# EAGLE design ASD2020 (EAGLE 6.3)
DATABASE: ./../../../../../Components/TinyCircuits_Part_Database.txt
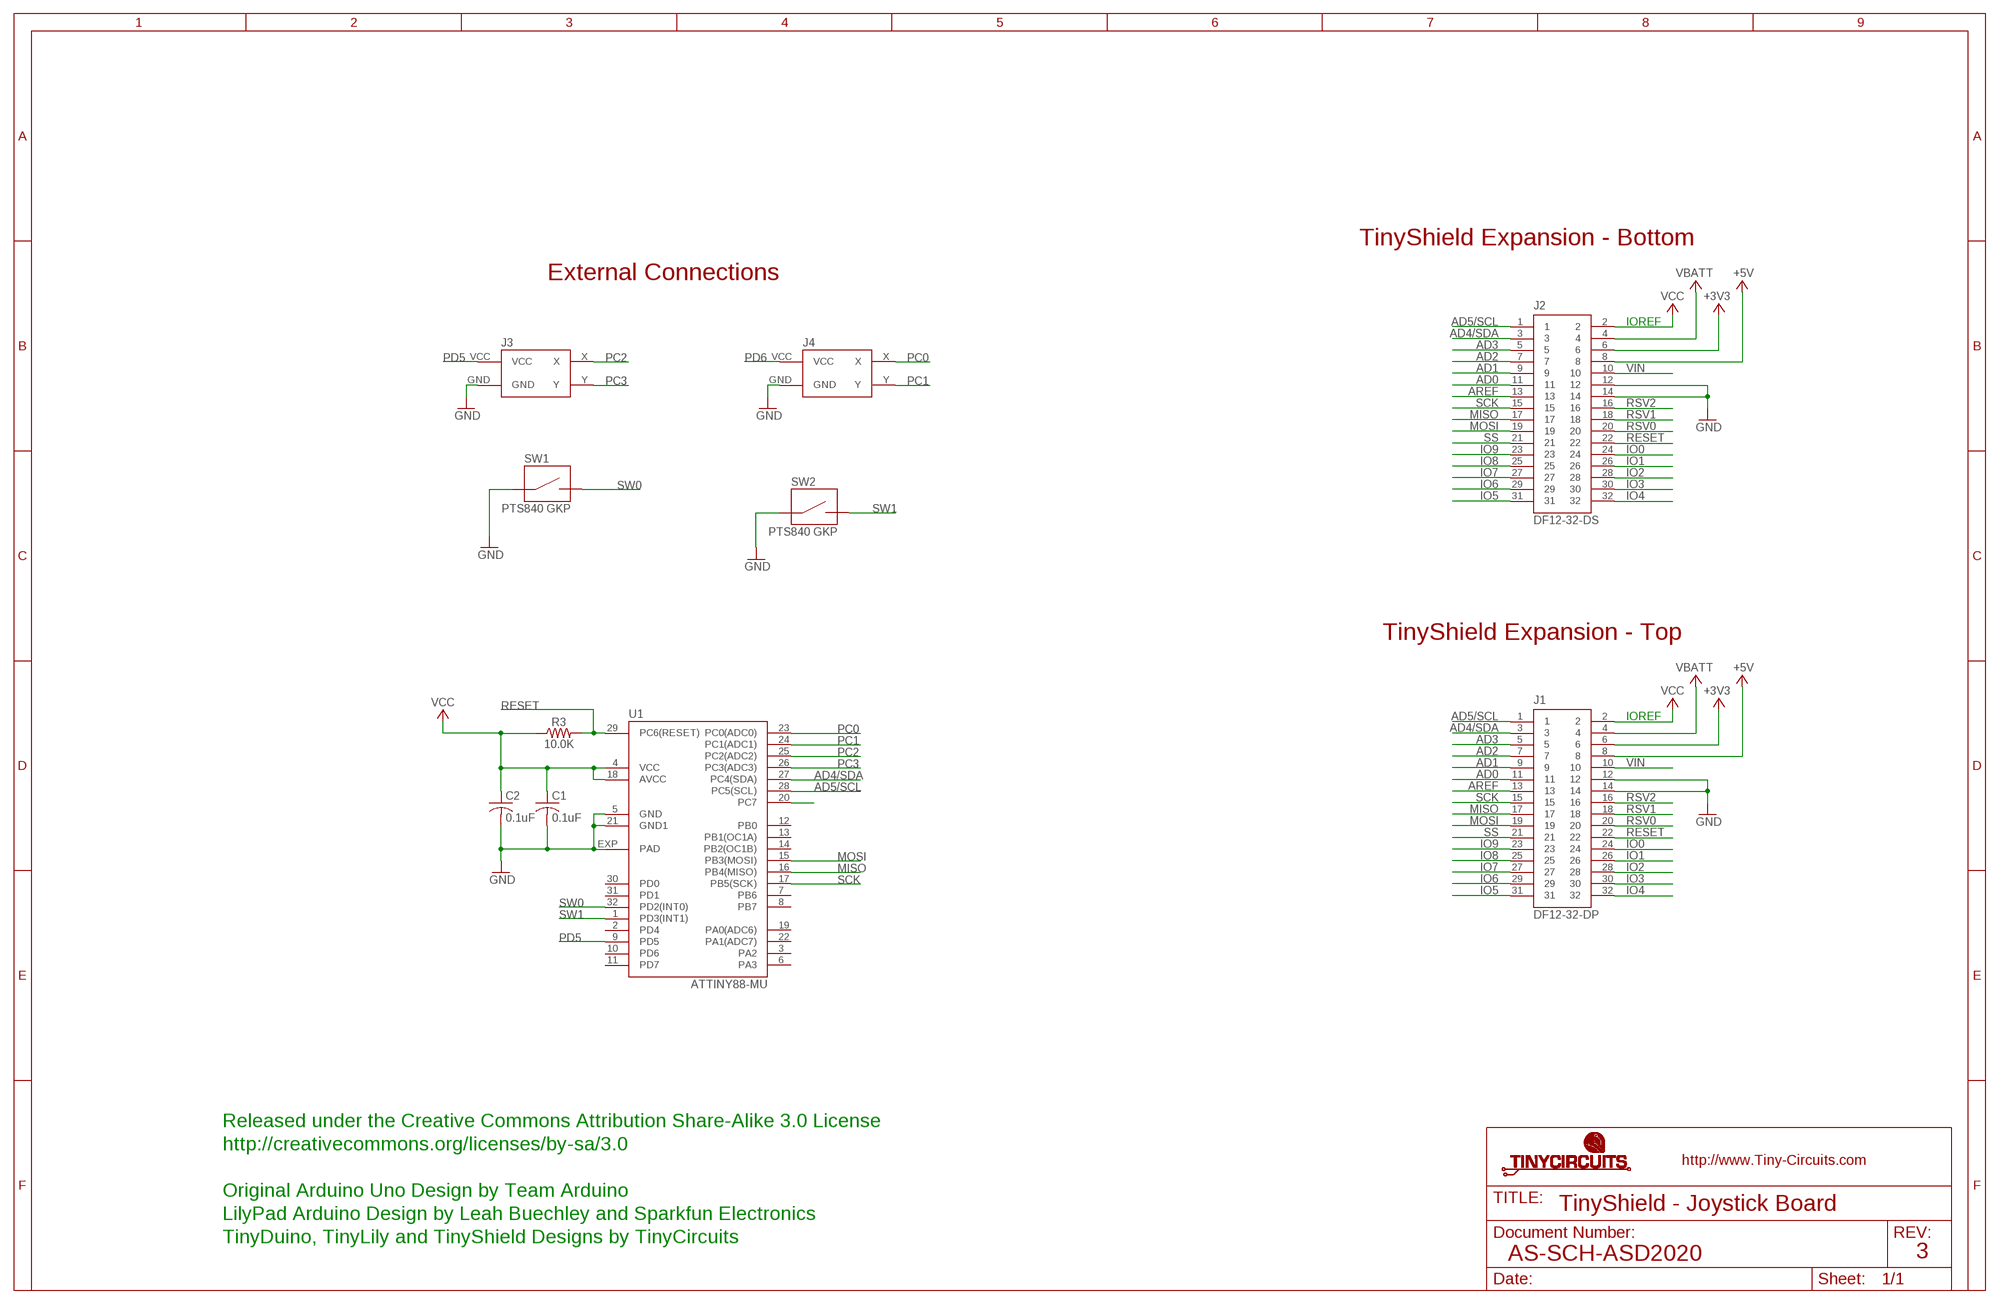
[diagram p0: schematic, sheet 1]

## Parts
C1  0.1uF  AS-ITM-00008  [C0402]
C2  0.1uF  AS-ITM-00008  [C0402]
J1  DF12-32-DP  AS-ITM-00015  [DF12-32-DP]
J2  DF12-32-DS  AS-ITM-00012  [DF12-32-DS]
J3  AS-ITM-00235  [PSPJOYSTICK]
J4  AS-ITM-00235  [PSPJOYSTICK]
R3  10.0K  AS-ITM-00032  [0402]
SW1  PTS840 GKP  AS-ITM-00236  [PTS840GKP]
SW2  PTS840 GKP  AS-ITM-00236  [PTS840GKP]
U1  ATTINY88-MU  AS-ITM-00214  [ATMEL_QFN32]

## Nets
+3V3: J1.6 J2.6
+5V: J1.8 J2.8
AD0: J1.11 J2.11
AD1: J1.9 J2.9
AD2: J1.7 J2.7
AD3: J1.5 J2.5
AD4/SDA: J1.3 J2.3 U1.27(PC4(SDA))
AD5/SCL: J1.1 J2.1 U1.28(PC5(SCL))
AREF: J1.13 J2.13
GND: C1.2 C2.2 J1.12 J1.14 J2.12 J2.14 J3.GND J4.GND SW1.1 SW1.2 SW2.1 SW2.2 U1.5(GND) U1.21(GND1) U1.EXP(PAD)
IO0: J1.24 J2.24
IO1: J1.26 J2.26
IO2: J1.28 J2.28
IO3: J1.30 J2.30
IO4: J1.32 J2.32
IO5: J1.31 J2.31
IO6: J1.29 J2.29
IO7: J1.27 J2.27
IO8: J1.25 J2.25
IO9: J1.23 J2.23
MISO: J1.17 J2.17 U1.16(PB4(MISO))
MOSI: J1.19 J2.19 U1.15(PB3(MOSI))
PC0: J4.X U1.23(PC0(ADC0))
PC1: J4.Y U1.24(PC1(ADC1))
PC2: J3.X U1.25(PC2(ADC2))
PC3: J3.Y U1.26(PC3(ADC3))
PD5: J3.VCC U1.9(PD5)
PD6: J4.VCC U1.20(PC7)
RESET: J1.22 J2.22 R3.2 U1.29(PC6(RESET))
RSV0: J1.20 J2.20
RSV1: J1.18 J2.18
RSV2: J1.16 J2.16
SCK: J1.15 J2.15 U1.17(PB5(SCK))
SS: J1.21 J2.21
SW0: SW1.3 SW1.4 U1.32(PD2(INT0))
SW1: SW2.3 SW2.4 U1.1(PD3(INT1))
VBATT: J1.4 J2.4
VCC: C1.1 C2.1 J1.2 J2.2 R3.1 U1.4(VCC) U1.18(AVCC)
VIN: J1.10 J2.10
Unconnected: U1.2(PD4) U1.3(PA2) U1.6(PA3) U1.7(PB6) U1.8(PB7) U1.10(PD6) U1.11(PD7) U1.12(PB0) U1.13(PB1(OC1A)) U1.14(PB2(OC1B)) U1.19(PA0(ADC6)) U1.22(PA1(ADC7)) U1.30(PD0) U1.31(PD1)

## Notes on the sheet
- TinyShield Expansion - Bottom
- External Connections
- IOREF
- TinyShield Expansion - Top
- IOREF
- Released under the Creative Commons Attribution Share-Alike 3.0 License
- http://creativecommons.org/licenses/by-sa/3.0
- Original Arduino Uno Design by Team Arduino
- TinyShield - Joystick Board
- LilyPad Arduino Design by Leah Buechley and Sparkfun Electronics
- TinyDuino, TinyLily and TinyShield Designs by TinyCircuits
- AS-SCH-ASD2020 | 3

## Library data of the parts
C1 C2 = tinycircuits:AS-ITM-00008: CAP CER 0.1UF 16V 10% X5R 0402; PARTNO: AS-ITM-00008
J1 = tinycircuits:AS-ITM-00015: CONN HEADER 32POS 3MM SMD 0.5MM; PARTNO: AS-ITM-00015
J2 = tinycircuits:AS-ITM-00012: CONN RECEPT 32POS 3MM SMD 0.5MM; PARTNO: AS-ITM-00012
J3 J4 = tinycircuits:AS-ITM-00235: Analog nub
R3 = tinycircuits:AS-ITM-00032: RES 10.0K OHM 1/16W 1% 0402 SMD; PARTNO: AS-ITM-00032
SW1 SW2 = tinycircuits:AS-ITM-00236: SWITCH TACTILE SPST-NO 0.05A 12V; PARTNO: AS-ITM-00236
U1 = tinycircuits:AS-ITM-00214: IC MCU 8BIT 8KB FLASH 32QFN; PARTNO: AS-ITM-00214

## Board
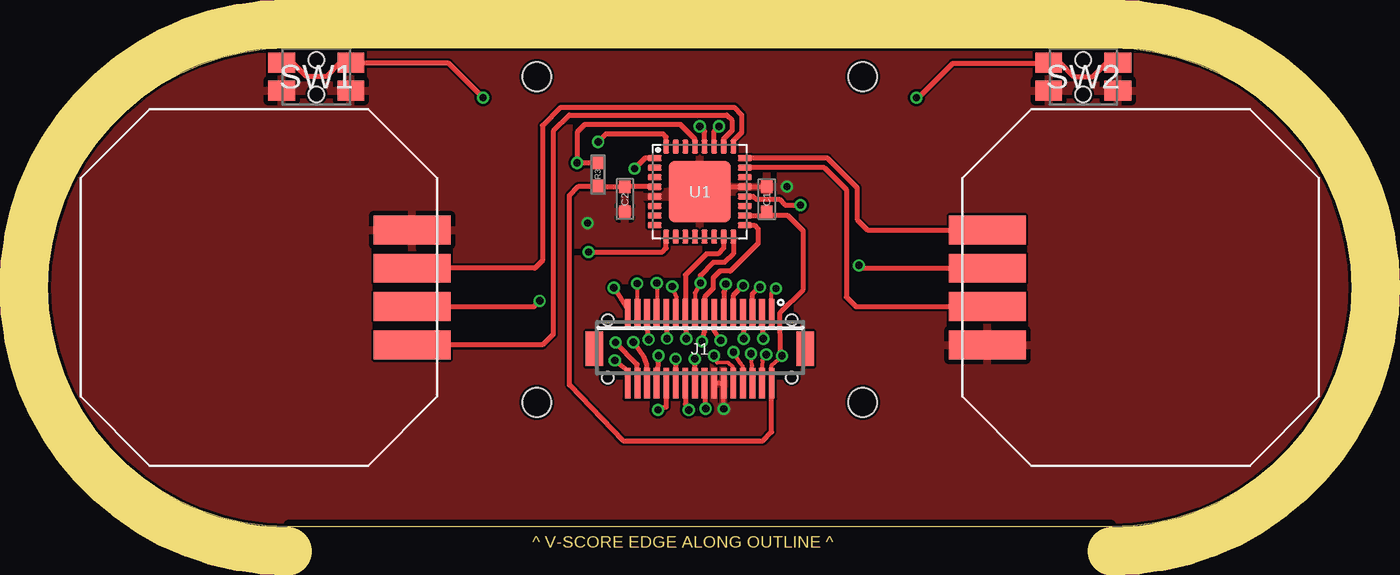
[diagram p1: board, top side]
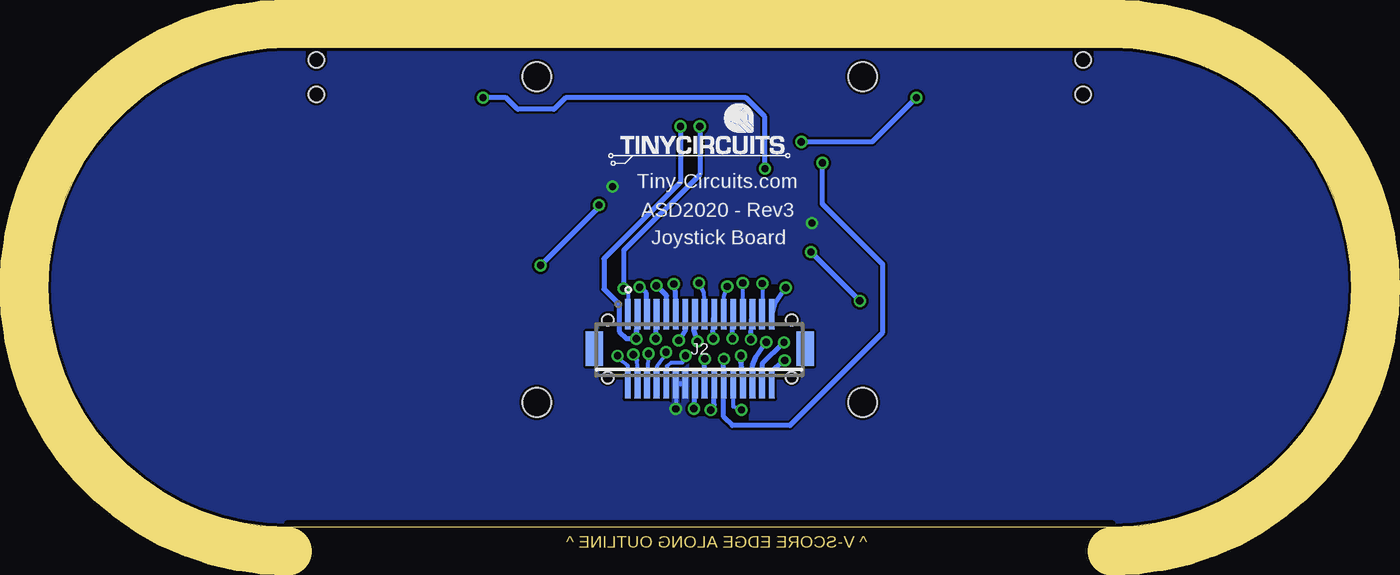
[diagram p2: board, bottom side, seen from below]

Size 68 x 25 mm. Coordinates in mm from the lower left corner, seen from the top.
Outline: 12.5,25 55.5,25 arc-90 68,12.5 arc-90 55.5,0 12.5,0 arc-90 0,12.5 arc-90 12.5,25
Copper layers (1*16): Top 0.035mm / dielectric 1.5mm / Bottom 0.035mm
Design rules "default *": minimum track width 8mil, minimum drill 15mil, track to track 5mil, track to pad 5mil, pad to pad 5mil, via to via 6mil, smd to smd 5mil, copper to edge 6mil, drill to drill 8mil, minimum pad ring 10mil, minimum via ring 5mil, stop-mask expansion 4mil, vias tented up to drill 25mil, thermal gap 10mil
Holes 1.5 mm at 25.5,23.5 42.5,23.5 42.5,6.5 25.5,6.5
tRestrict: 1 lines
bRestrict: 1 lines
Milling: 5 lines

### Footprints (pad centres in the part's own frame; a part is rotated, then mirrored left to right if it is on the bottom)
C0402 = smd 0.65 x 0.6: 1 -0.65,0; 2 0.65,0
DF12-32-DP = smd 0.3 x 1.6: 1 -3.75,-1.8; 2 -3.75,1.8; 3 -3.25,-1.8; 4 -3.25,1.8; 5 -2.75,-1.8; 6 -2.75,1.8; 7 -2.25,-1.8; 8 -2.25,1.8; 9 -1.75,-1.8; 10 -1.75,1.8; 11 -1.25,-1.8; 12 -1.25,1.8; 13 -0.75,-1.8; 14 -0.75,1.8; 15 -0.25,-1.8; 16 -0.25,1.8; 17 0.25,-1.8; 18 0.25,1.8; 19 0.75,-1.8; 20 0.75,1.8; 21 1.25,-1.8; 22 1.25,1.8; 23 1.75,-1.8; 24 1.75,1.8; 25 2.25,-1.8; 26 2.25,1.8; 27 2.75,-1.8; 28 2.75,1.8; 29 3.25,-1.8; 30 3.25,1.8; 31 3.75,-1.8; 32 3.75,1.8 | smd 0.9 x 1.8: F1 -5.5,0; F2 5.5,0 | hole 0.6: -4.8,1.5; 4.8,1.5
DF12-32-DS = smd 0.3 x 1.6: 1 -3.75,1.8; 2 -3.75,-1.8; 3 -3.25,1.8; 4 -3.25,-1.8; 5 -2.75,1.8; 6 -2.75,-1.8; 7 -2.25,1.8; 8 -2.25,-1.8; 9 -1.75,1.8; 10 -1.75,-1.8; 11 -1.25,1.8; 12 -1.25,-1.8; 13 -0.75,1.8; 14 -0.75,-1.8; 15 -0.25,1.8; 16 -0.25,-1.8; 17 0.25,1.8; 18 0.25,-1.8; 19 0.75,1.8; 20 0.75,-1.8; 21 1.25,1.8; 22 1.25,-1.8; 23 1.75,1.8; 24 1.75,-1.8; 25 2.25,1.8; 26 2.25,-1.8; 27 2.75,1.8; 28 2.75,-1.8; 29 3.25,1.8; 30 3.25,-1.8; 31 3.75,1.8; 32 3.75,-1.8 | smd 0.9 x 1.8: F1 -5.5,0; F2 5.5,0 | hole 0.6: -4.8,1.5; 4.8,1.5
PSPJOYSTICK = smd 4 x 1.5: GND -8,-3; VCC -8,1; X -8,-1; Y -8,3
0402 = smd 0.65 x 0.55: 1 -0.6,0; 2 0.6,0
PTS840GKP = smd 1.4 x 1.05: 1 -1.8,0.725; 2 1.8,0.725; 3 -1.8,-0.725; 4 1.8,-0.725 | hole 0.8: 0,0.925; 0,-0.875
ATMEL_QFN32 = smd 0.711 x 0.305: 1 -2.351,1.75; 2 -2.351,1.25; 3 -2.351,0.75; 4 -2.351,0.25; 5 -2.351,-0.25; 6 -2.351,-0.75; 7 -2.351,-1.25; 8 -2.351,-1.75; 17 2.351,-1.75; 18 2.351,-1.25; 19 2.351,-0.75; 20 2.351,-0.25; 21 2.351,0.25; 22 2.351,0.75; 23 2.351,1.25; 24 2.351,1.75 | smd 0.305 x 0.711: 9 -1.75,-2.351; 10 -1.25,-2.351; 11 -0.75,-2.351; 12 -0.25,-2.351; 13 0.25,-2.351; 14 0.75,-2.351; 15 1.25,-2.351; 16 1.75,-2.351; 25 1.75,2.351; 26 1.25,2.351; 27 0.75,2.351; 28 0.25,2.351; 29 -0.25,2.351; 30 -0.75,2.351; 31 -1.25,2.351; 32 -1.75,2.351 | smd 3.2 x 3.2: EXP 0,0

### Placement (x,y rotation side)
C1  37.5,17.1 90 top
C2  30.1,17.1 270 top
J1  34,9.3 180 top
J2  34,9.3 0 bottom
J3  11,12.5 180 top
J4  57,12.5 0 top
R3  28.7,18.4 90 top
SW1  14,23.5 180 top
SW2  54,23.5 180 top
U1  34,17.5 0 top
U$1  [DOCFIELD-TINYCIRCUITS-PCB]  77.91,-5 0 top  (outside the outline)

### Tracks (layer width: path | path; a pad name or v marks a point on that pad's centre or on a via)
+3V3  (via drill 0.38)
  Top 0.203: J2.6 36.74,8.4 v36.67,9.04
  Bottom 0.203: v36.67,9.04 36.71,8.44 J2.6
+5V  (via drill 0.38)
  Top 0.203: v35.76,9.12 36.11,8.56 36.23,8.39 J2.8
  Top 0.254: J2.8
  Bottom 0.203: J2.8 36.23,8.38 36.11,8.55 35.83,8.9 v35.76,9.12
AD0  (via drill 0.38)
  Top 0.254: v35.35,12.68 35.26,12.25 J2.11
  Bottom 0.254: J2.11 35.28,12.24 v35.35,12.68
AD1  (via drill 0.38)
  Top 0.254: J2.9 35.74,12.07 v36.26,12.59
  Bottom 0.254: v36.26,12.59 35.73,12.07 J2.9
AD2  (via drill 0.38)
  Top 0.254: v36.29,9.83 36.31,10.05 J2.7
  Bottom 0.254: J2.7 36.27,10.86 v36.29,9.83
AD3  (via drill 0.38)
  Top 0.254: J2.5 36.73,12.14 v37.15,12.51
  Bottom 0.254: v37.15,12.51 36.78,12.2 J2.5
AD4/SDA  (via drill 0.38)
  Top 0.254: v37.31,9.83 37.31,10 J2.3 | U1.27 34.75,20.65 v35,20.9
  Bottom 0.254: J2.3 37.28,10.86 v37.31,9.83 | v35,20.9 35,18 39,14 39,12.42 38.21,11.63 38.21,10.21 37.83,9.83 v37.31,9.83 | 37.31,10.49 v37.31,9.83
AD5/SCL  (via drill 0.38)
  Top 0.203: J2.1 37.75,12.22 v37.97,12.44
  Top 0.254: U1.28 34.25,20.65 v34,20.9
  Bottom 0.203: v37.97,12.44 v37.96,12.44 37.74,12.21 37.74,11.11 J2.1
  Bottom 0.254: v34,20.9 34,18.4 37.97,14.43 v37.97,12.44
AREF  (via drill 0.38)
  Top 0.254: J2.13 34.75,10.25 v35.09,9.73
  Bottom 0.254: v35.09,9.73 34.76,10.24 J2.13
GND  (via drill 0.38)
  Top 0.203: v35.25,6.16 J2.12
  Top 0.254: J2.12 J2.14 | U1.EXP 34.25,17.75 C1.2
  Bottom 0.203: J2.12 35.25,6.27 v35.25,6.16
  Bottom 0.254: J2.12 J2.14
  other vias: 38.55,17.76 28.15,15.86
  pour Top: 12.5,25 55.5,25 arc-90 68,12.5 arc-90 55.5,0 12.5,0 arc-90 0,12.5 arc-90
  pour Bottom: 12.5,25 55.5,25 arc-90 68,12.5 arc-90 55.5,0 12.5,0 arc-90 0,12.5 arc-90
IO0  (via drill 0.38)
  Top 0.254: J2.24 32.25,6.26 v31.82,6.11
  Bottom 0.203: v31.82,6.11 31.98,6.17 32.25,6.27 J2.24
  Bottom 0.254: J2.24
IO1  (via drill 0.38)
  Top 0.254: v31.85,8.94 J2.26
  Bottom 0.254: 31.85,8.66 J2.26 v31.85,8.94
IO2  (via drill 0.38)
  Top 0.254: v30.53,9.64 31.07,8.89 31.22,8.49 31.29,7.61 31.26,7.51 J2.28
  Bottom 0.254: J2.28 31.24,8.43 31.07,8.88 v30.53,9.64
IO3  (via drill 0.38)
  Top 0.254: 30.74,7.51 J2.30 30.73,8.49 v29.61,9.63
  Bottom 0.254: v29.61,9.63 30.75,8.51 30.77,7.53 J2.30
IO4  (via drill 0.38)
  Top 0.254: J2.32 30.25,8.14 v29.56,8.69
  Bottom 0.254: v29.56,8.69 29.61,8.65 30.21,8.18 30.21,8.14 30.26,8.1 J2.32
IO5  (via drill 0.38)
  Top 0.254: v29.52,12.49 30.23,11.38 J2.31
  Bottom 0.254: J2.31 30.11,11.64 v29.52,12.49
IO6  (via drill 0.38)
  Top 0.203: J2.29 30.75,12.75 30.74,12.76 30.73,12.78 v30.74,12.7
  Top 0.254: J2.29
  Bottom 0.203: v30.74,12.7 30.74,11.11 J2.29
IO7  (via drill 0.38)
  Top 0.254: v31.33,9.78 31.31,9.9 J2.27
  Bottom 0.254: J2.27 31.29,10.76 v31.33,9.78
IO8  (via drill 0.38)
  Top 0.203: v31.76,12.73 31.76,11.11 J2.25
  Bottom 0.203: J2.25 v31.75,12.72 v31.76,12.73
IO9  (via drill 0.38)
  Top 0.254: v32.29,9.83 32.31,9.98 J2.23
  Bottom 0.254: J2.23 32.28,10.59 v32.29,9.83
MISO  (via drill 0.38)
  Top 0.203: v34.03,12.73 33.75,12.21 J2.17
  Top 0.254: U1.16 35.75,14.25 35.3,13.8 34.7,13.8 34.03,13.13 v34.03,12.73
  Bottom 0.203: J2.17 33.76,11.11 33.76,11.87 33.78,12.25 v34.03,12.73
MOSI  (via drill 0.38)
  Top 0.254: v33.3,9.83 33.31,9.95 J2.19 33.25,13.15 34.35,14.25 34.95,14.25 35.25,14.55 U1.15
  Bottom 0.254: J2.19 33.27,10.76 v33.3,9.83
PC0
  Top 0.254: U1.23 40.5,18.75 41.65,17.6 41.65,12 42.15,11.5 J4.X
PC1
  Top 0.254: U1.24 40.65,19.25 42.2,17.7 42.2,16.05 42.75,15.5 J4.Y
PC2
  Top 0.254: U1.25 35.75,20.15 36.2,20.6 36.2,21.5 35.8,21.9 26.75,21.9 25.8,20.95 25.8,13.9 25.4,13.5 J3.X
PC3
  Top 0.254: U1.26 35.25,20.25 35.7,20.7 35.7,21.2 35.4,21.5 27.2,21.5 26.35,20.65 26.35,10.05 25.8,9.5 J3.Y
PD5  (via drill 0.38)
  Top 0.254: J3.VCC 25.35,11.5 v25.65,11.8 | v28.2,14.35 32.05,14.35 32.25,14.55 U1.9
  Bottom 0.254: v25.65,11.8 v28.2,14.35
PD6  (via drill 0.38)
  Top 0.254: U1.20 36.8,17.25 36.95,17.1 38.15,17.1 38.45,16.8 v39.25,16.8 | v42.3,13.65 42.45,13.5 J4.VCC
  Bottom 0.254: v39.25,16.8 39.25,16.7 v42.3,13.65
RESET  (via drill 0.38)
  Top 0.254: v32.74,8.77 J2.22 | U1.29 33.75,20.25 33,21 28,21 27.6,20.6 v27.6,19 R3.2
  Bottom 0.254: v32.74,8.77 32.75,8.69 J2.22 32.75,5.75 32.3,5.3 29.3,5.3 24.45,10.15 24.45,13.7 27.6,16.85 v27.6,19
RSV0  (via drill 0.38)
  Top 0.254: J2.20 33.25,6.4 v33.42,6.1
  Bottom 0.254: v33.42,6.1 33.26,6.39 J2.20
RSV1  (via drill 0.38)
  Top 0.254: v33.74,8.77 33.74,7.51 J2.18
  Bottom 0.254: J2.18 33.75,8.72 v33.74,8.77
RSV2  (via drill 0.38)
  Top 0.254: J2.16 34.27,6.18 v34.31,6.17
  Bottom 0.254: v34.31,6.17 J2.16
SCK  (via drill 0.38)
  Top 0.254: v34.11,9.68 34.26,10.18 J2.15 | J2.15 | U1.17 36.85,15.75 37.05,15.55 37.05,14.8 35.6,13.35 35.05,13.35 34.7,13 34.7,12.45 34.25,12 J2.15
  Bottom 0.254: J2.15 34.29,10.26 v34.11,9.68
SS  (via drill 0.38)
  Top 0.203: J2.21 32.77,11.12 32.8,12 32.57,12.53 v32.57,12.55
  Bottom 0.203: v32.57,12.55 32.75,12.03 J2.21
SW0  (via drill 0.38)
  Top 0.254: U1.32 32.25,20.35 32.1,20.5 29.1,20.5 v28.7,20.1 | v22.7,22.4 20.9,24.2 15.82,24.2 SW1.3 15.23,24.23 14.5,23.5 13.5,23.5 12.8,24.2 12.23,24.2 SW1.4
  Bottom 0.254: v28.7,20.1 25,20.1 v22.7,22.4
SW1  (via drill 0.38)
  Top 0.254: U1.1 31.15,19.25 v30.6,18.7 | v45.3,22.4 45.4,22.4 47.2,24.2 52.17,24.2 SW2.4 52.77,24.23 53.5,23.5 54.5,23.5 55.2,24.2 55.77,24.2 SW2.3
  Bottom 0.254: v30.6,18.7 30.6,21.4 31.6,22.4 41,22.4 41.6,21.8 43.5,21.8 44.1,22.4 v45.3,22.4
VBATT  (via drill 0.38)
  Top 0.203: v37.47,9 37.27,8.71 37.26,8.37 J2.4
  Bottom 0.203: J2.4 37.25,8.36 37.26,8.69 v37.47,9
VCC  (via drill 0.38)
  Top 0.203: J2.2 37.75,8.42 38.14,8.76 v38.29,8.93
  Top 0.254: v38.29,8.93 38.27,8.93 38.2,9 38.19,11.19 39.4,12.4 39.4,15.45 38.6,16.25 37.7,16.25 C1.1 37.3,16.25 U1.18 | U1.4 C2.1 28.75,17.75 R3.1 28.65,17.75 27.65,17.75 27.2,17.3 27.2,7.4 30,4.5 37.3,4.5 37.75,4.95 J2.2
  Bottom 0.203: v38.29,8.93 38.15,8.75 37.77,8.44 J2.2
VIN  (via drill 0.38)
  Top 0.203: J2.10 35.73,8.36 35.51,8.55 34.91,8.57 v34.74,8.94
  Bottom 0.203: v34.74,8.94 34.92,8.57 35.48,8.56 35.72,8.39 J2.10

### Text on the board
Dimension: ^ V-SCORE EDGE ALONG OUTLINE ^
bPlace: Tiny-Circuits.com | ASD2020 - Rev3 | Joystick Board
Document: FABRICATION DRAWING | NOTES: | 1. PRINTED CIRCUIT BOARD MADE FROM NEMA GRADE FR-4 EPOXY LAMINATE | WITH 1 OUNCE COPPER PLATING AND .024 THICKNESS. | 2. ALL DIMENSIONS ARE GIVEN IN INCHES. | 3. CIRCUIT PATHS ARE FOR REFERENCE ONLY. | 4. HOLE SIZES SHOWN ARE FINISHED DIAMETERS AFTER PLATING. | 5. BOARD PLATED USING REFLOW OR SIMILAR METHOD. | 6. BOARD TO HAVE BLUE SOLDER MASK ON PLATED SURFACES USING WET FILM | 7. SILKSCREEN BOARD USING WHITE INK. | SR100 OR SR1010 EPOXY. EQUIVALENT WET OR DRY FILM MAY BE USED. | 8. THE FOLLOWING INFORMATION APPLIES TO THIS BOARD: | * 2 COPPER LAYERS | * .024 BOARD THICKNESS | * REQUIRES TOP SIDE SILKSCREEN | Released under the Creative Commons Attribution Share-Alike 3.0 License | http://creativecommons.org/licenses/by-sa/3.0 | Original Arduino Uno Design by Team Arduino | LilyPad Arduino Design by Leah Buechley and Sparkfun Electronics | TinyDuino, TinyLily and TinyShield Designs by TinyCircuits | TinyShield - Joystick Board | AS-PCB-ASD2020 | 3